# Altium schematic sheet 1_P1.schdoc
size 309 x 223 mm; Symbol: Sheet-Symbol_A4; Device: Sheet-Symbol_A4; Company: 嘉立创EDA; Version: V1.0; Page Size: A4; @Project Name: SlimeNano; @Page Count: 1; @Update Date: 2024-11-28; @Create Date: 2024-11-05; @Schematic Name: Schematic1; @Page No: 1; @Page Name: P1; @Board Name: Board1; @Create Time: 02:49:08; @Update Time: 00:53:05
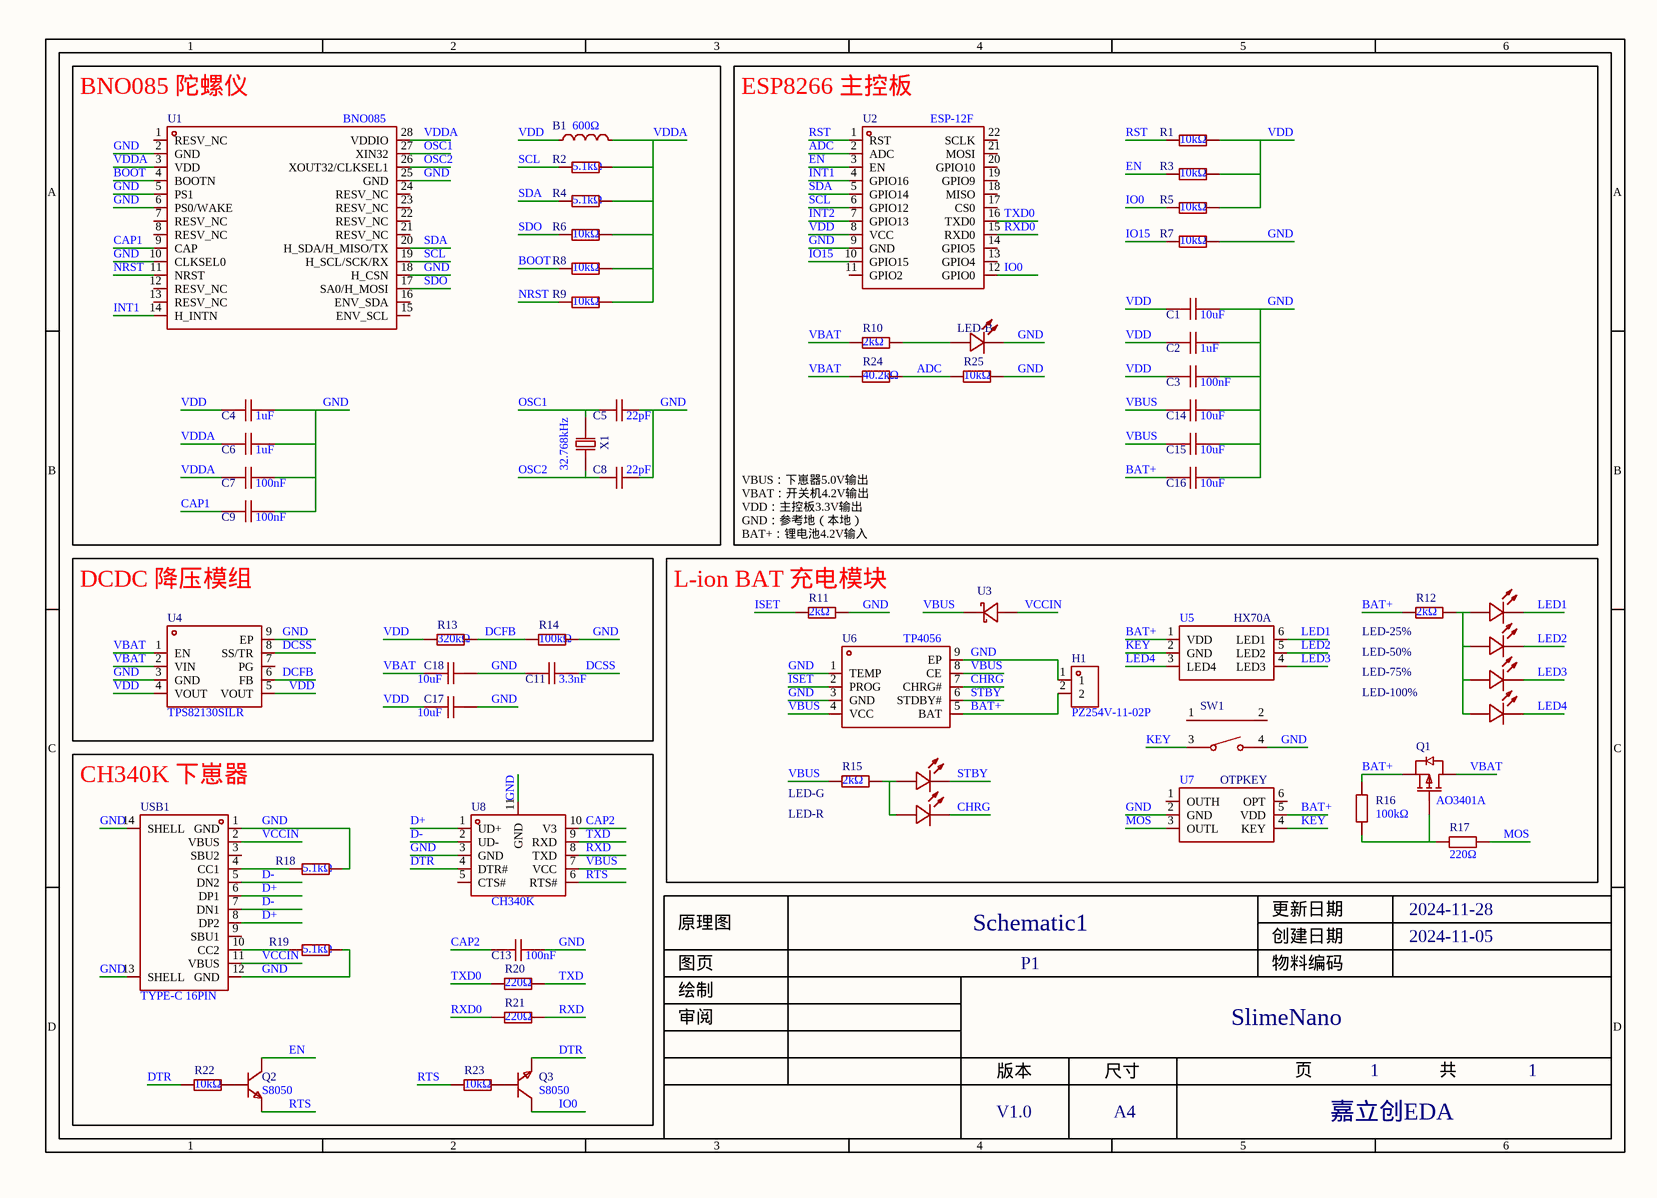
[diagram p0: 1_P1.schdoc]

## Parts
B1  600Ω  [R0603]
C1  10uF  [C0603]
C2  1uF  [C0603]
C3  100nF  [C0603]
C4  1uF  [C0603]
C5  22pF  [C0603]
C6  1uF  [C0603]
C7  100nF  [C0603]
C8  22pF  [C0603]
C9  100nF  [C0603]
C11  3.3nF  [C0603]
C13  100nF  [C0603]
C14  10uF  [C0603]
C15  10uF  [C0603]
C16  10uF  [C0603]
C17  10uF  [C0603]
C18  10uF  [C0603]
H1  PZ254V-11-02P  [HDR-TH_2P-P2.54-V-M]
LED-25%  KT-0603W  [R0603]  (value not drawn)
LED-50%  KT-0603W  [R0603]  (value not drawn)
LED-75%  KT-0603W  [R0603]  (value not drawn)
LED-100%  KT-0603W  [R0603]  (value not drawn)
LED-B  KT-0603W  [R0603]  (value not drawn)
LED-G  KT-0603W  [R0603]  (value not drawn)
LED-R  KT-0603W  [R0603]  (value not drawn)
Q1  AO3401A  [SOT-23_L2.9-W1.3-P1.90-LS2.4-BR]
Q2  S8050  [SOT-23_L2.9-W1.3-P1.90-LS2.4-BR]
Q3  S8050  [SOT-23_L2.9-W1.3-P1.90-LS2.4-BR]
R1  10kΩ  [R0603]
R2  5.1kΩ  [R0603]
R3  10kΩ  [R0603]
R4  5.1kΩ  [R0603]
R5  10kΩ  [R0603]
R6  10kΩ  [R0603]
R7  10kΩ  [R0603]
R8  10kΩ  [R0603]
R9  10kΩ  [R0603]
R10  2kΩ  [R0603]
R11  2kΩ  [R0603]
R12  2kΩ  [R0603]
R13  320kΩ  [R0603]
R14  100kΩ  [R0603]
R15  2kΩ  [R0603]
R16  100kΩ  [R0603]
R17  220Ω  [R0603]
R18  5.1kΩ  [R0603]
R19  5.1kΩ  [R0603]
R20  220Ω  [R0603]
R21  220Ω  [R0603]
R22  10kΩ  [R0603]
R23  10kΩ  [R0603]
R24  40.2kΩ  [R0603]
R25  10kΩ  [R0603]
SW1  TS24CA  [SW-SMD_TS24CA]  (value not drawn)
U1  BNO085  [BNO08X]
U2  Manufacturer Part: ESP-12F  [WIFIM-SMD_ESP-12F-ESP8266MOD]  (hidden comment: 2.4GHz)
U3  1N5819W  [SOD-123_L2.7-W1.6-LS3.7-FD]  (value not drawn)
U4  TPS82130SILR  [USIP-8_L3.0-W2.8-P0.65-TL-EP]
U5  (no value)  [SOT-23-6_L2.9-W1.7-P0.95-LS2.8-BL]
U6  TP4056  [ESOP-8_L4.9-W3.9-P1.27-LS6.0-BL-EP]
U7  (no value)  [SOT-23-6_L2.9-W1.7-P0.95-LS2.8-BL]
U8  CH340K  [ESOP-10_L4.9-W3.9-P1.00-LS6.0-BL-EP]
USB1  TYPE-C 16PIN  [USB-C-SMD_TYPE-C-6PIN-2MD-073]
X1  32.768kHz  [FC-135R_L3.2-W1.5]

## Blocks framed on the sheet
BNO085 陀螺仪: B1 C4-C9 R2 R4 R6 R8 R9 U1 X1
ESP8266 主控板: C1-C3 C14-C16 LED-B R1 R3 R5 R7 R10 R24 R25 U2
DCDC 降压模组: C11 C17 C18 R13 R14 U4
L-ion BAT 充电模块: H1 LED-25% LED-50% LED-75% LED-100% LED-G LED-R Q1 R11 R12 R15-R17 SW1 U3 U5-U7
CH340K 下崽器: C13 Q2 Q3 R18-R23 U8 USB1

## Nets
ADC: R24.1 R25.2 U2.2(ADC)
BAT+: C16.2 H1.2 Q1.2(S) R12.2 R16.1 U5.1(VDD) U6.5(BAT) U7.5(VDD)
BOOT: R8.1 U1.4(BOOTN)
CAP1: C9.2 U1.9(CAP)
CAP2: C13.2 U8.10(V3)
CHRG: LED-R.2(K) U6.7(CHRG#)
D+: U8.1(UD+) USB1.6(DP1) USB1.8(DP2)
D-: U8.2(UD-) USB1.5(DN2) USB1.7(DN1)
DCFB: R13.1 R14.1 U4.6(FB)
DCSS: C11.1 U4.8(SS/TR)
DTR: Q3.2 R22.1 U8.4(DTR#)
EN: Q2.3 R3.1 U2.3(EN)
GND: C1.1 C2.1 C3.1 C4.1 C5.2 C6.1 C7.1 C8.2 C9.1 C11.2 C13.1 C14.1 C15.1 C16.1 C17.2 C18.2 H1.1 LED-B.2(K) R7.2 R11.1 R14.2 R18.2 R19.2 R25.1 SW1.4 U1.2(GND) U1.5(PS1) U1.6(PS0/WAKE) U1.10(CLKSEL0) U1.18(H_CSN) U1.25(GND) U2.9(GND) U4.3(GND) U4.9(EP) U6.1(TEMP) U6.3(GND) U6.9(EP) U7.2(GND) U8.3(GND) U8.11(GND) USB1.1(GND) USB1.12(GND) USB1.13(SHELL) USB1.14(SHELL)
INT1: U1.14(H_INTN) U2.4(GPIO16)
INT2: U2.7(GPIO13)
IO0: Q3.3 R5.1 U2.12(GPIO0)
IO15: R7.1 U2.10(GPIO15)
ISET: R11.2 U6.2(PROG)
KEY: SW1.3 U5.2(GND) U7.4(KEY)
LED1: LED-25%.2(K) U5.6(LED1)
LED2: LED-50%.2(K) U5.5(LED2)
LED3: LED-75%.2(K) U5.4(LED3)
LED4: LED-100%.2(K) U5.3(LED4)
MOS: R17.2 U7.3(OUTL)
NRST: R9.1 U1.11(NRST)
OSC1: C5.1 U1.27(XIN32) X1.2
OSC2: C8.1 U1.26(XOUT32/CLKSEL1) X1.1
RST: R1.1 U2.1(RST)
RTS: Q2.2 R23.1 U8.6(RTS#)
RXD: R21.1 U8.8(TXD)
RXD0: R21.2 U2.15(RXD0)
SCL: R2.2 U1.19(H_SCL/SCK/RX) U2.6(GPIO12)
SDA: R4.2 U1.20(H_SDA/H_MISO/TX) U2.5(GPIO14)
SDO: R6.1 U1.17(SA0/H_MOSI)
STBY: LED-G.2(K) U6.6(STDBY#)
TXD: R20.1 U8.9(RXD)
TXD0: R20.2 U2.16(TXD0)
VBAT: C18.1 Q1.3(D) R10.2 R24.2 U4.1(EN) U4.2(VIN)
VBUS: C14.2 C15.2 R15.1 U3.2(K) U6.4(VCC) U6.8(CE) U8.7(VCC)
VCCIN: U3.1(A) USB1.2(VBUS) USB1.11(VBUS)
VDD: B1.1 C1.2 C2.2 C3.2 C4.2 C17.1 R1.2 R3.2 R5.2 R13.2 U2.8(VCC) U4.4(VOUT) U4.5(VOUT)
VDDA: B1.2 C6.2 C7.2 R2.1 R4.1 R6.2 R8.2 R9.2 U1.3(VDD) U1.28(VDDIO)
NetLED-25%_1: LED-25%.1(A) LED-50%.1(A) LED-75%.1(A) LED-100%.1(A) R12.1
NetLED-B_1: LED-B.1(A) R10.1
NetLED-G_1: LED-G.1(A) LED-R.1(A) R15.2
NetQ1_1: Q1.1(G) R16.2 R17.1
NetQ2_1: Q2.1 R22.2
NetQ3_1: Q3.1 R23.2
NetR18_1: R18.1 USB1.4(CC1)
NetR19_1: R19.1 USB1.10(CC2)

Not connected (* = marked no-connect by the designer): SW1 1 2; U1 1(RESV_NC) 7(RESV_NC) 8(RESV_NC) 12(RESV_NC) 13(RESV_NC) 15(ENV_SCL) 16(ENV_SDA) 21(RESV_NC) 22(RESV_NC) 23(RESV_NC) 24(RESV_NC); U2 11(GPIO2) 13(GPIO4) 14(GPIO5) 17(CS0) 18(MISO) 19(GPIO9) 20(GPIO10) 21(MOSI) 22(SCLK); U4 7(PG); U7 1(OUTH) 6(OPT); U8 5(CTS#); USB1 3(SBU2) 9(SBU1)

## Notes on the sheet
- (near R11) VBUS：下崽器5.0V输出
  VBAT：开关机4.2V输出
  VDD：主控板3.3V输出
  GND：参考地（本地）
  BAT+：锂电池4.2V输入
- 1
- 2
- 3
- 4
- 5
- 6
- A
- B
- C
- 原理图
- Schematic1
- 创建日期
- 更新日期
- 2024-11-28
- 2024-11-05
- 审阅
- 绘制
- 图页
- P1
- 物料编码
- SlimeNano
- D
- 版本
- 尺寸
- 页
- 共
- V1.0
- A4
- 嘉立创EDA

## Library data of the parts
B1 = BLM18PG121SN1D: Manufacturer: muRata(村田); Symbol: BLM18PG121SN1D_C14709; Add into BOM: yes; Impedance @ Frequency: 120Ω@100MHz; Tolerance: ±25%; DC Resistance: 50mΩ; Current Rating: 2A; Circuits: 1; Device: BLM18PG121SN1D; LCSC Part Name: 单路 0603磁珠 阻抗120Ω@100MHz; Supplier Part: C14709; Manufacturer Part: 600Ω; Supplier Footprint: 0603; JLCPCB Part Class: 扩展库; Datasheet: https://atta.szlcsc.com/upload/public/pdf/source/20130704/1457706621422.pdf; Supplier: LCSC; Convert to PCB: yes
C1-C4 C6 C7 C9 C11 C13-C16 = CGA0603X7R104K500JT: Manufacturer: HRE(芯声); Add into BOM: yes; Tolerance: ±10%; Voltage Rated: 50V; Temperature Coefficient: X7R; Symbol: CGA0603X7R104K500JT; Device: CGA0603X7R104K500JT; LCSC Part Name: 100nF ±10% 50V; Manufacturer Part: CGA0603X7R104K500JT; Supplier Footprint: 0603; JLCPCB Part Class: 扩展库; Supplier: LCSC; Convert to PCB: yes
  C1 C14-C16: Value: 10uF
  C2 C4 C6: Value: 1uF
  C3 C7 C9 C13: Supplier Part: C6119867; Value: 100nF
  C11: Value: 3.3nF
C5 C8 = CL10C220JB8NNNC: Manufacturer: SAMSUNG(三星); Add into BOM: yes; Tolerance: ±5%; Voltage Rated: 50V; Temperature Coefficient: C0G; Symbol: CL10C220JB8NNNC; Device: CL10C220JB8NNNC; LCSC Part Name: 22pF ±5% 50V; Supplier Part: C1653; Manufacturer Part: CL10C220JB8NNNC; Supplier Footprint: 0603; JLCPCB Part Class: 基础库; Datasheet: https://atta.szlcsc.com/upload/public/pdf/source/20160218/1457707763339.pdf; Supplier: LCSC; Convert to PCB: yes; Value: 22pF
C17 C18 = CGA0603X5R106K100JT: Manufacturer: HRE(芯声); Add into BOM: yes; Tolerance: ±10%; Voltage Rated: 10V; Temperature Coefficient: X5R; Symbol: CGA0603X5R106K100JT; Device: CGA0603X5R106K100JT; LCSC Part Name: 10uF ±10% 10V; Supplier Part: C6119842; Manufacturer Part: CGA0603X5R106K100JT; Supplier Footprint: 0603; JLCPCB Part Class: 扩展库; Supplier: LCSC; Convert to PCB: yes; Value: 10uF
H1 = PZ254V-11-02P: Manufacturer: XFCN(兴飞); Add into BOM: yes; Pin Structure: 1x2P; Pitch: 2.54mm; Circluar Pins/Square Pins: 方针; Symbol: PZ254V-11-02P; Device: PZ254V-11-02P; LCSC Part Name: 间距:2.54mm 1x2P 直插 方针; Supplier Part: C492401; Manufacturer Part: PZ254V-11-02P; Supplier Footprint: 插件,P=2.54mm; JLCPCB Part Class: 扩展库; Datasheet: https://atta.szlcsc.com/upload/public/pdf/source/20200309/C492401_A812433581A9B211A7FFA413ADDFF0E5.pdf; Supplier: LCSC; Convert to PCB: yes; Row Spacing: -; Mounting Type: 直插; Number of Rows: 单排; Number of Pins: 2P; Current Rating (Max): -; Voltage Rating (Max): -; Length of Mating Pin: 6mm; Insulation Height: 2.5mm; Length of End Connection Pin: 3mm; Contact Material: 黄铜; Contact Plating: -; Operating Temperature Range: -40℃~+105℃; Color: 黑色
LED-25% LED-50% LED-75% LED-100% LED-B LED-G LED-R = KT-0603W: Manufacturer: KENTO; Symbol: 0603White light_C2290; Add into BOM: yes; Emitted Color: 白色; Device: KT-0603W; LCSC Part Name: 0603 白灯 高亮; Supplier Part: C2290; Manufacturer Part: KT-0603W; Supplier Footprint: 0603; JLCPCB Part Class: 基础库; Datasheet: https://atta.szlcsc.com/upload/public/pdf/source/20221101/4C23D5C85BA051E44A00B833D0A41468.pdf; Supplier: LCSC; Convert to PCB: yes
Q1 = AO3401A_C15127: Manufacturer: AOS; Add into BOM: yes; Type: 1个P沟道; Drain Source Voltage (Vdss): 30V; Continuous Drain Current (Id): 4A; Power Dissipation (Pd): 1.4W; Drain Source On Resistance (RDS(on)@Vgs,Id): 44mΩ@10V,4.3A; Gate Threshold Voltage (Vgs(th)@Id): 1.3V@250uA; Total Gate Charge (Qg@Vgs): 12.2nC@4.5V; Input Capacitance (Ciss@Vds): 1.2nF@15V; Symbol: AO3401A; Device: AO3401A_C15127; LCSC Part Name: 1个P沟道 耐压:30V 电流:4A; Supplier Part: C15127; Manufacturer Part: AO3401A; Supplier Footprint: SOT-23; JLCPCB Part Class: 基础库; Datasheet: https://atta.szlcsc.com/upload/public/pdf/source/20160507/1462613609053.pdf; Supplier: LCSC; Convert to PCB: yes; Operating Temperature: -55℃~+150℃@(Tj)
Q2 Q3 = S8050_C181158: Manufacturer: Hottech(合科泰); Add into BOM: yes; Transistor Type: NPN; Collector Current (Ic): 500mA; Collector-Emitter Breakdown Voltage (Vceo): 25V; Power Dissipation (Pd): 300mW; Transition Frequency (fT): 150MHz; Collector Cut-Off Current (Icbo): 100nA; Collector-Emitter Saturation Voltage (VCE(sat)@Ic,Ib): 600mV@500mA,50mA; Symbol: S8050_C181158; Device: S8050_C181158; LCSC Part Name: NPN 电流:500mA 耐压:25V; Supplier Part: C181158; Manufacturer Part: S8050; Supplier Footprint: SOT-23; JLCPCB Part Class: 扩展库; Datasheet: https://atta.szlcsc.com/upload/public/pdf/source/20220506/D987F39D56F2975D34EC7947E75C4ABC.pdf; Supplier: LCSC; Convert to PCB: yes; Operating Temperature: -
R1 R3 R5-R9 R13 R14 R16 R17 R22 R23 = 0603WAF1002T5E: Manufacturer: UNI-ROYAL(厚声); Add into BOM: yes; Tolerance: ±1%; Power(Watts): 100mW; Overload Voltage (Max): 75V; Temperature Coefficient: ±100ppm/℃; Symbol: 0603WAF1002T5E; Device: 0603WAF1002T5E; LCSC Part Name: 厚膜电阻 10kΩ ±1% 100mW; Manufacturer Part: 0603WAF1002T5E; Supplier Footprint: 0603; JLCPCB Part Class: 基础库; Datasheet: https://atta.szlcsc.com/upload/public/pdf/source/20200306/C422600_1E6D84923E4A46A82E41ADD87F860B5C.pdf; Supplier: LCSC; Convert to PCB: yes; Type: 厚膜电阻; Operating Temperature Range: -55℃~+155℃
  R1 R3 R5-R9 R22 R23: Supplier Part: C25804; Value: 10kΩ
  R13: Value: 320kΩ
  R14 R16: Value: 100kΩ
  R17: Value: 220Ω
R2 R4 R20 R21 = 0603WAF4701T5E: Manufacturer: UNI-ROYAL(厚声); Add into BOM: yes; Tolerance: ±1%; Power(Watts): 100mW; Overload Voltage (Max): 75V; Temperature Coefficient: ±100ppm/℃; Symbol: 0603WAF4701T5E; Device: 0603WAF4701T5E; LCSC Part Name: 4.7kΩ ±1% 100mW 厚膜电阻; Manufacturer Part: 0603WAF4701T5E; Supplier Footprint: 0603; JLCPCB Part Class: 基础库; Datasheet: https://atta.szlcsc.com/upload/public/pdf/source/20200306/C422600_1E6D84923E4A46A82E41ADD87F860B5C.pdf; Supplier: LCSC; Convert to PCB: yes; Type: 厚膜电阻; Operating Temperature Range: -55℃~+155℃
  R2 R4: Value: 5.1kΩ
  R20 R21: Value: 220Ω
R10 R12 R24 R25 = 0603WAF1001T5E: Manufacturer: UNI-ROYAL(厚声); Add into BOM: yes; Tolerance: ±1%; Power(Watts): 100mW; Overload Voltage (Max): 75V; Temperature Coefficient: ±100ppm/℃; Symbol: 0603WAF1001T5E; Device: 0603WAF1001T5E; LCSC Part Name: 1kΩ ±1% 100mW 厚膜电阻; Manufacturer Part: 0603WAF1001T5E; Supplier Footprint: 0603; JLCPCB Part Class: 基础库; Datasheet: https://atta.szlcsc.com/upload/public/pdf/source/20200306/C422600_1E6D84923E4A46A82E41ADD87F860B5C.pdf; Supplier: LCSC; Convert to PCB: yes; Type: 厚膜电阻; Operating Temperature Range: -55℃~+155℃
  R10 R12: Value: 2kΩ
  R24: Value: 40.2kΩ
  R25: Value: 10kΩ
R11 R15 = 0603WAF1003T5E: Manufacturer: UNI-ROYAL(厚声); Add into BOM: yes; Tolerance: ±1%; Power(Watts): 100mW; Overload Voltage (Max): 75V; Temperature Coefficient: ±100ppm/℃; Symbol: 0603WAF1003T5E; Device: 0603WAF1003T5E; LCSC Part Name: 100kΩ ±1% 100mW 厚膜电阻; Manufacturer Part: 0603WAF1003T5E; Supplier Footprint: 0603; JLCPCB Part Class: 基础库; Datasheet: https://atta.szlcsc.com/upload/public/pdf/source/20200306/C422600_1E6D84923E4A46A82E41ADD87F860B5C.pdf; Supplier: LCSC; Convert to PCB: yes; Type: 厚膜电阻; Value: 2kΩ; Operating Temperature Range: -55℃~+155℃
R18 R19 = 0603WAF5101T5E: Manufacturer: UNI-ROYAL(厚声); Add into BOM: yes; Tolerance: ±1%; Power(Watts): 100mW; Overload Voltage (Max): 75V; Temperature Coefficient: ±100ppm/℃; Symbol: 0603WAF5101T5E; Device: 0603WAF5101T5E; LCSC Part Name: 5.1kΩ ±1% 100mW 厚膜电阻; Supplier Part: C23186; Manufacturer Part: 0603WAF5101T5E; Supplier Footprint: 0603; JLCPCB Part Class: 基础库; Datasheet: https://atta.szlcsc.com/upload/public/pdf/source/20200306/C422600_1E6D84923E4A46A82E41ADD87F860B5C.pdf; Supplier: LCSC; Convert to PCB: yes; Type: 厚膜电阻; Value: 5.1kΩ; Operating Temperature Range: -55℃~+155℃
SW1 = TS24CA: Manufacturer: SHOU HAN(首韩); Add into BOM: yes; Circuit: 单刀单掷; Actuator Style: 矩形按钮; Switch Length: 4.55mm; Switch Width: 1.8mm; Switch Height: 3.5mm; Contact Current: 50mA; Voltage Rating (DC): 12V; Symbol: TS24CA; Device: TS24CA; LCSC Part Name: 4.55*1.8*3.5mm 卧贴 轻触开关; Supplier Part: C393942; Manufacturer Part: TS24CA; Supplier Footprint: SMD; JLCPCB Part Class: 扩展库; Datasheet: https://atta.szlcsc.com/upload/public/pdf/source/20190521/C393942_591A9E318887EFA4274D34029981AD99.pdf; Supplier: LCSC; Convert to PCB: yes; Mounting Style: 卧贴; With Lamp: -; Mechanical Life: -
U1 = BNO085_C5189642: Manufacturer: CEVA; Add into BOM: yes; Symbol: BNO085_C5189642; Device: BNO085_C5189642; LCSC Part Name: BNO085; Supplier Part: C5189642; Manufacturer Part: BNO085; Supplier Footprint: LGA-28(3.8x5.2); JLCPCB Part Class: 扩展库; Datasheet: https://atta.szlcsc.com/upload/public/pdf/source/20240415/44FC701F4FB8EB2E8EF4F9E45B4206E6.pdf; Supplier: LCSC; Convert to PCB: yes
U2 = ESP-12F(ESP8266MOD): Manufacturer: Ai-Thinker(安信可); Add into BOM: yes; Core Processor: ESP8266芯片; Support Interface: GPIO；UART；I2C；PWM；SPI；ADC; Antenna Type: 板载PCB天线; Output Power: 16dBm; Operating Voltage: 3.3V; Receive  Current: 120mA; Send  Current: 170mA; Sensitivity: -90dBm; Symbol: ESP-12F(ESP8266MOD); Device: ESP-12F(ESP8266MOD); LCSC Part Name: 完整的802.11b/g/nWi-FiSoC模块; Supplier Part: C82891; Supplier Footprint: SMD,16x24mm; JLCPCB Part Class: 扩展库; Datasheet: https://atta.szlcsc.com/upload/public/pdf/source/20210219/C82891_ABD84A460F4F056A2757267CCCA4B508.pdf; Supplier: LCSC; Convert to PCB: yes; Wireless Standard: -; Value: 2.4GHz; Operating Temperature: -40℃~+85℃
U3 = 1N5819W_C5451628: Manufacturer: HXY MOSFET(华轩阳电子); Add into BOM: yes; Diode Configuration: 独立式; Forward Voltage (Vf@If): 600mV@200mA; Reverse Voltage (Vr): 40V; Average Rectified Current (Io): 350mA; Reverse Leakage Current (Ir): 5uA@30V; Peak forward surge current: 2A; Symbol: 1N5819W_C5451628; Device: 1N5819W_C5451628; LCSC Part Name: 电压:40V 电流:350mA; Supplier Part: C5451628; Manufacturer Part: 1N5819W; Supplier Footprint: SOD-123; JLCPCB Part Class: 扩展库; Datasheet: https://atta.szlcsc.com/upload/public/pdf/source/20230718/8CE4C7F16758863028CFFFD6944BDCD1.pdf; Supplier: LCSC; Convert to PCB: yes
U4 = TPS82130SILR: Manufacturer: TI(德州仪器); Add into BOM: yes; Symbol: TPS82130SILR; Device: TPS82130SILR; LCSC Part Name: TPS82130SILR; Supplier Part: C473914; Manufacturer Part: TPS82130SILR; Supplier Footprint: USIP-8; JLCPCB Part Class: 扩展库; Datasheet: https://www.ti.com/cn/lit/gpn/tps82130; Supplier: LCSC; Convert to PCB: yes
U5 = HX70A: Add into BOM: yes; Symbol: HX70A; Device: HX70A; Convert to PCB: yes
U6 = TP4056_C725790: Manufacturer: UMW(友台半导体); Add into BOM: yes; Symbol: TP4056_C725790; Device: TP4056_C725790; LCSC Part Name: TP4056; Supplier Part: C725790; Manufacturer Part: TP4056; Supplier Footprint: ESOP-8; JLCPCB Part Class: 扩展库; Datasheet: https://atta.szlcsc.com/upload/public/pdf/source/20231109/CF74897CE79A500F7FE27A45ADCCC631.pdf; Supplier: LCSC; Convert to PCB: yes
U7 = OTPKEY: Add into BOM: yes; Symbol: OTPKEY; Device: OTPKEY; Convert to PCB: yes
U8 = CH340K_C18208922: Manufacturer: WCH(南京沁恒); Add into BOM: yes; Symbol: CH340K_C18208922; Device: CH340K_C18208922; LCSC Part Name: CH340K 人工转编带; Supplier Part: C18208922; Manufacturer Part: CH340K; Supplier Footprint: ESSOP-10-150mil-1mm; JLCPCB Part Class: 扩展库; Datasheet: https://atta.szlcsc.com/upload/public/pdf/source/20240313/9D833A30DDFD16C064A7ADE10A944019.pdf; Supplier: LCSC; Convert to PCB: yes
USB1 = TYPE-C 16PIN 2MD(073): Manufacturer: SHOU HAN(首韩); Add into BOM: yes; Gender: 母; Number of Contacts: 16P; Number of Ports: 1; Current Rating - Power (Max): 5A; Rated Voltage (Max): 5V; Connect-Disconnect Life: 5千次; Core Colour: 黑色; Symbol: TYPE-C 16PIN 2MD(073); Device: TYPE-C 16PIN 2MD(073); LCSC Part Name: Type-C 母 卧贴; Supplier Part: C2765186; Manufacturer Part: TYPE-C 16PIN; Supplier Footprint: SMD; JLCPCB Part Class: 扩展库; Datasheet: https://atta.szlcsc.com/upload/public/pdf/source/20211123/39B17C16241EAC15C5E277BDA434118E.pdf; Supplier: LCSC; Convert to PCB: yes; Connector Type: Type-C; Standard: USB 3.1; Mounting Style: 卧贴; Operating Temperature Range: -25℃~+85℃
X1 = Q13FC13500004_C32346: Manufacturer: EPSON(爱普生); Symbol: Q13FC1350000400; Add into BOM: yes; Crystal Type: 贴片晶振; Normal temperature Frequency Tolerance: ±20ppm; External load capacitor: 12.5pF; Equivalent Series Resistance (ESR): 70kΩ; Device: Q13FC13500004_C32346; LCSC Part Name: 32.768kHz ±20ppm 12.5pF; Supplier Part: C32346; Manufacturer Part: Q13FC13500004; Supplier Footprint: SMD3215-2P; JLCPCB Part Class: 基础库; Datasheet: https://atta.szlcsc.com/upload/public/pdf/source/20240418/0E0FF5F0356BA3753F616001439D1416.pdf; Supplier: LCSC; Convert to PCB: yes; Value: 32.768kHz; Operating Temperature: -40℃~+85℃